# EasyEDA Pro project Charlieplexing.eprj

# Schematic Schematic1
Board Name: Board1; Create Date: 2025-11-15; Page Name: P1; Project Name: Charlieplexing; Schematic Name: Schematic1; Update Date: 2025-11-15; Company: EasyEDA.com; Page Size: A4; Version: V1.0
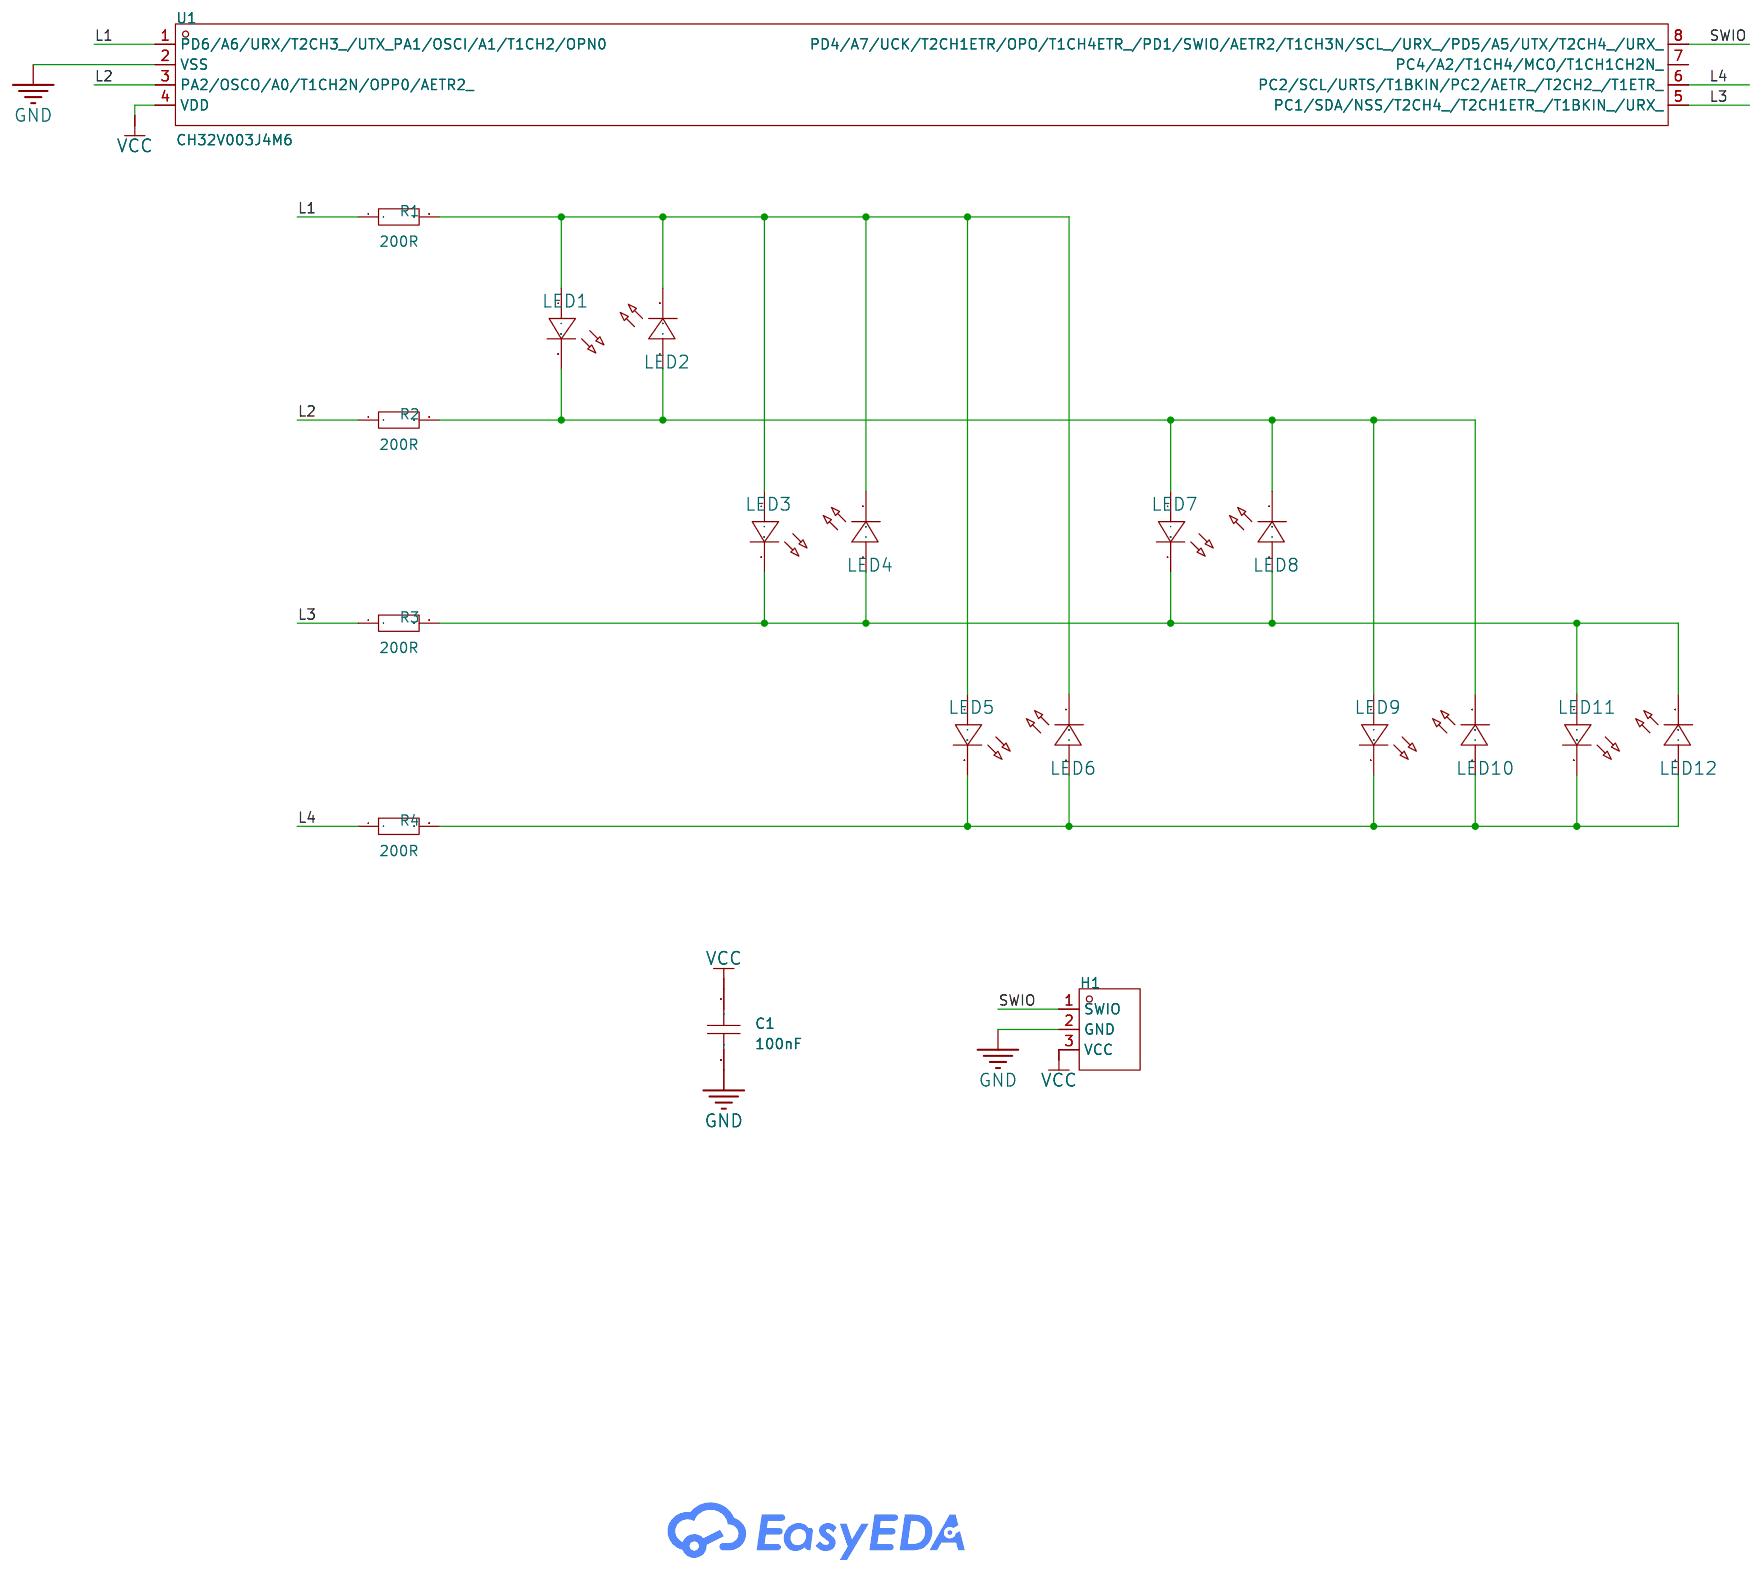
[diagram p0: schematic sheet]

## Parts
C1  100nF  [C0603]
H1  -  [HDR-TH_3P-P2.54-V-M]
LED1  -  [LED0603-R-RD]
LED2  -  [LED0603-R-RD]
LED3  -  [LED0603-R-RD]
LED4  -  [LED0603-R-RD]
LED5  -  [LED0603-R-RD]
LED6  -  [LED0603-R-RD]
LED7  -  [LED0603-R-RD]
LED8  -  [LED0603-R-RD]
LED9  -  [LED0603-R-RD]
LED10  -  [LED0603-R-RD]
LED11  -  [LED0603-R-RD]
LED12  -  [LED0603-R-RD]
R1  200R  [R0603]
R2  200R  [R0603]
R3  200R  [R0603]
R4  200R  [R0603]
U1  CH32V003J4M6  [SOP-8_L4.9-W3.8-P1.27-LS6.0-BL]

## Library data of the parts
C1 = CAP_0603: Supplier Footprint: 0603
H1 = CH32V003 SWIO Header: Supplier Footprint: Through
LED1-LED12 = LED_0603-R: Supplier Footprint: 0603
R1-R4 = Res_0603: Supplier Footprint: 0603
U1 = CH32V003J4M6: Supplier Part: C5346354; Manufacturer: WCH(南京沁恒); Supplier Footprint: SOP-8; JLCPCB Part Class: Extended Part; Datasheet: https://atta.szlcsc.com/upload/public/pdf/source/20240313/8FAFD0DE100342130E64AE37B01CD8FD.pdf; Supplier: LCSC

## Nets
GND: C1.2 H1.2(GND) U1.2(VSS)
VCC: C1.1 H1.3(VCC) U1.4(VDD)
L1: R1.1 U1.1(PD6/A6/URX/T2CH3_/UTX_PA1/OSCI/A1/T1CH2/OPN0)
L2: R2.1 U1.3(PA2/OSCO/A0/T1CH2N/OPP0/AETR2_)
L3: R3.1 U1.5(PC1/SDA/NSS/T2CH4_/T2CH1ETR_/T1BKIN_/URX_)
L4: R4.1 U1.6(PC2/SCL/URTS/T1BKIN/PC2/AETR_/T2CH2_/T1ETR_)
SWIO: H1.1(SWIO) U1.8(PD4/A7/UCK/T2CH1ETR/OPO/T1CH4ETR_/PD1/SWIO/AETR2/T1CH3N/SCL_/URX_/PD5/A5/UTX/T2CH4_/URX_)
$1N184: LED1.1(A) LED2.2(C) LED3.1(A) LED4.2(C) LED5.1(A) LED6.2(C) R1.2
$1N692: LED3.2(C) LED4.1(A) LED7.2(C) LED8.1(A) LED11.1(A) LED12.2(C) R3.2
$1N745: LED5.2(C) LED6.1(A) LED9.2(C) LED10.1(A) LED11.2(C) LED12.1(A) R4.2
Net-(LED1-2): LED1.2(C) LED2.1(A) LED7.1(A) LED8.2(C) LED9.1(A) LED10.2(C) R2.2

Not connected (* = marked no-connect by the designer): U1 7(PC4/A2/T1CH4/MCO/T1CH1CH2N_)

# Schematic Schematic1_1
Board Name: 0402; Create Date: 2025-11-15; Page Name: P1; Project Name: Charlieplexing; Schematic Name: Schematic1_1; Update Date: 2025-11-16; Company: EasyEDA.com; Page Size: A4; Version: V1.0
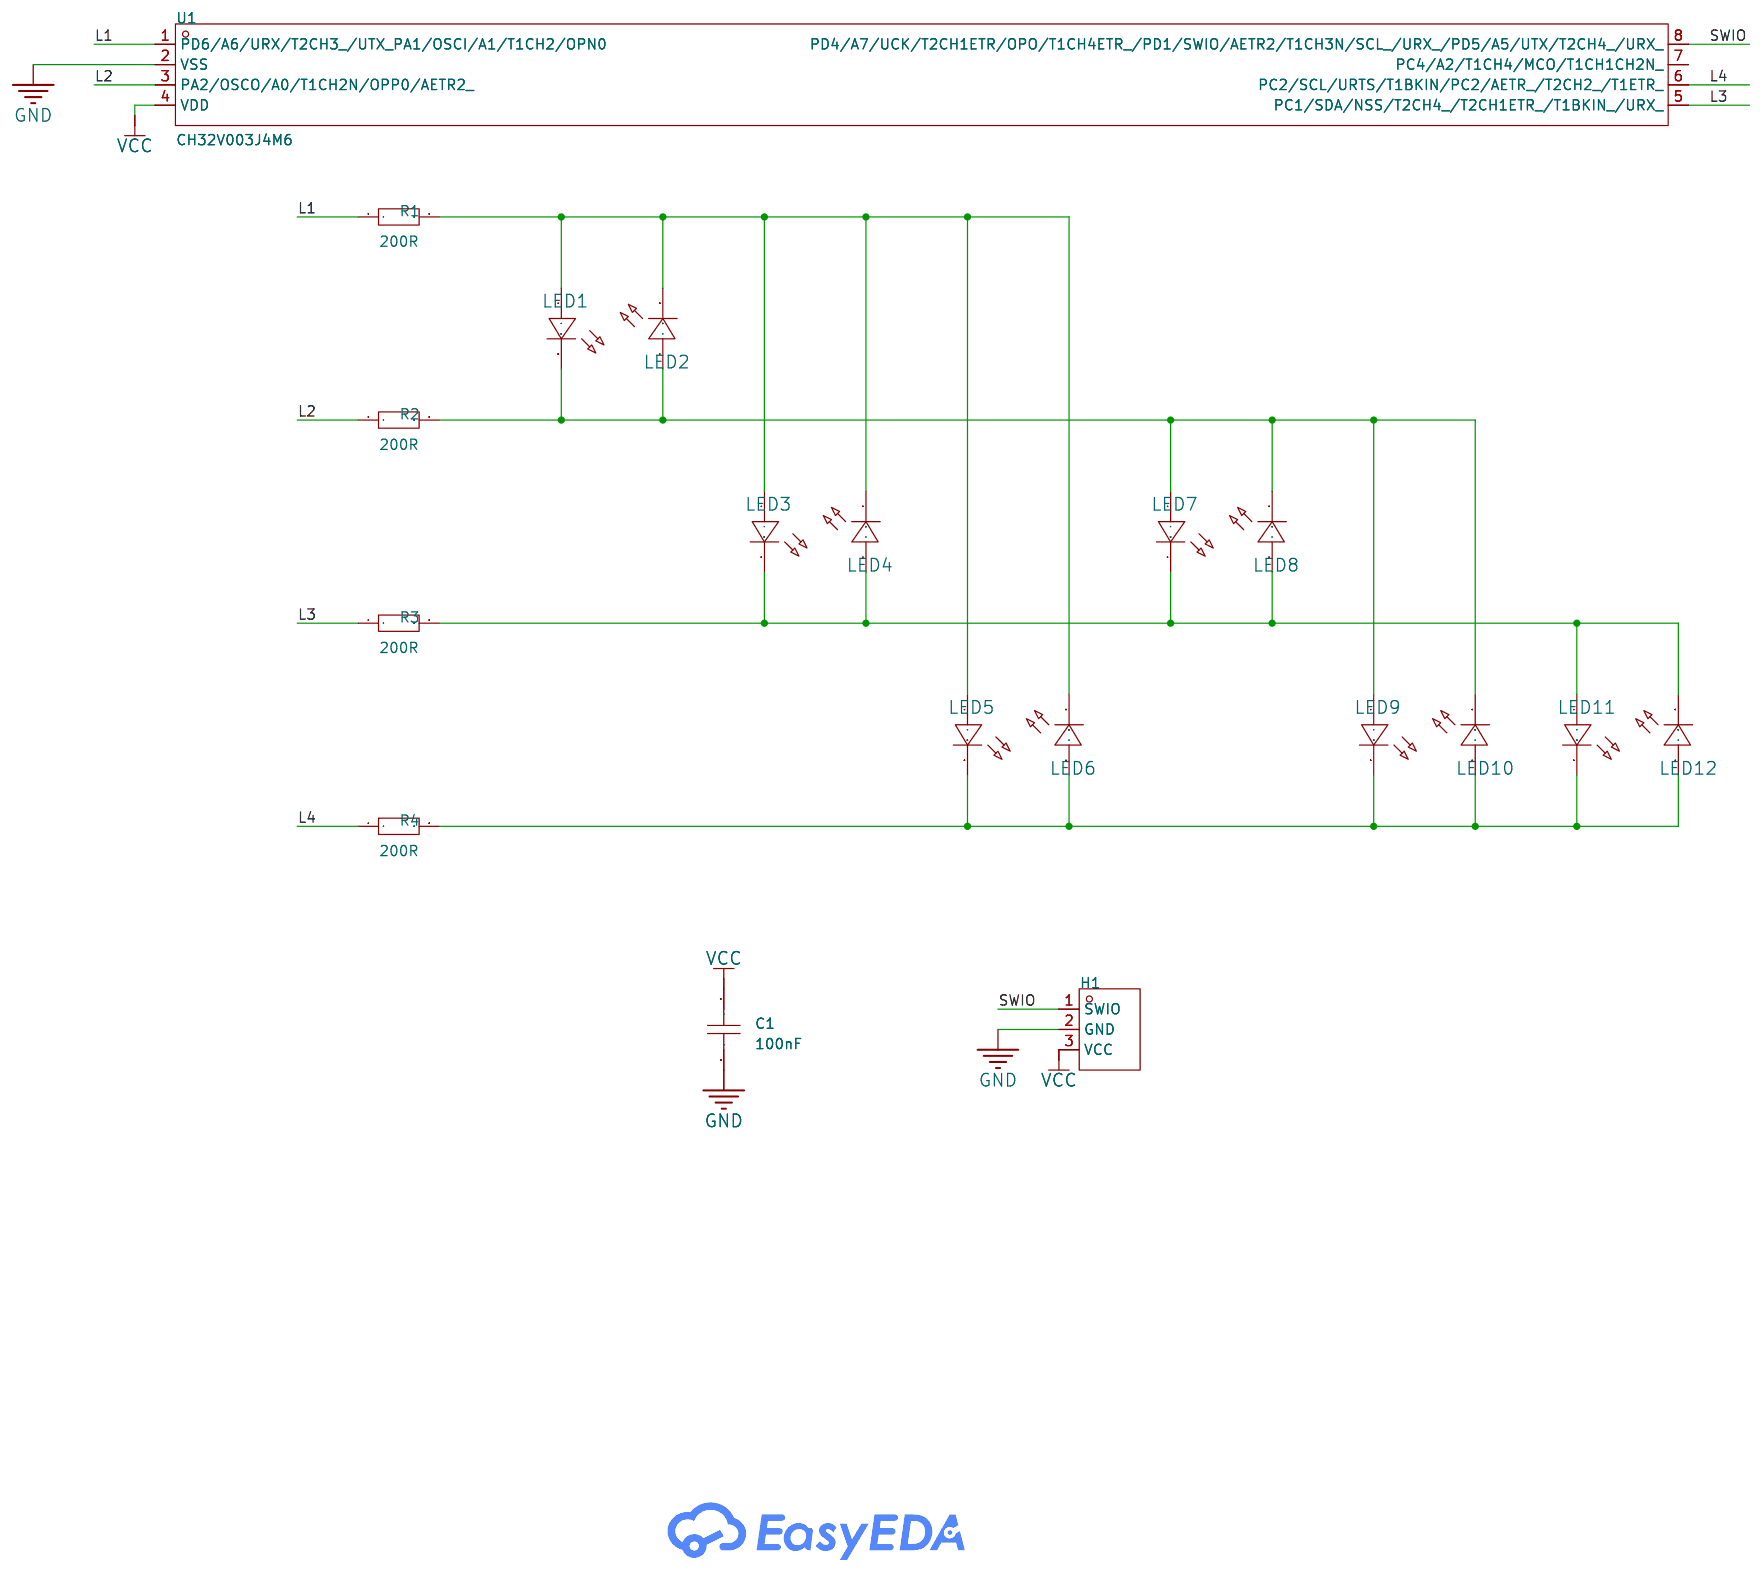
[diagram p1: schematic sheet]

## Parts
C1  100nF  [C0603]
H1  -  [HDR-TH_3P-P2.54-V-M]
LED1  -  [LED0402-R-RD_WHITE]
LED2  -  [LED0402-R-RD_WHITE]
LED3  -  [LED0402-R-RD_WHITE]
LED4  -  [LED0402-R-RD_WHITE]
LED5  -  [LED0402-R-RD_WHITE]
LED6  -  [LED0402-R-RD_WHITE]
LED7  -  [LED0402-R-RD_WHITE]
LED8  -  [LED0402-R-RD_WHITE]
LED9  -  [LED0402-R-RD_WHITE]
LED10  -  [LED0402-R-RD_WHITE]
LED11  -  [LED0402-R-RD_WHITE]
LED12  -  [LED0402-R-RD_WHITE]
R1  200R  [R0402]
R2  200R  [R0402]
R3  200R  [R0402]
R4  200R  [R0402]
U1  CH32V003J4M6  [SOP-8_L4.9-W3.8-P1.27-LS6.0-BL]

## Library data of the parts
C1 = CAP_0603: Supplier Footprint: 0603
H1 = CH32V003 SWIO Header: Supplier Footprint: Through
LED1-LED12 = LED_0603-R: Supplier Footprint: 0603
R1-R4 = Res_0603: Supplier Footprint: 0603
U1 = CH32V003J4M6: Supplier Part: C5346354; Manufacturer: WCH(南京沁恒); Supplier Footprint: SOP-8; JLCPCB Part Class: Extended Part; Datasheet: https://atta.szlcsc.com/upload/public/pdf/source/20240313/8FAFD0DE100342130E64AE37B01CD8FD.pdf; Supplier: LCSC

## Nets
GND: C1.2 H1.2(GND) U1.2(VSS)
VCC: C1.1 H1.3(VCC) U1.4(VDD)
L1: R1.1 U1.1(PD6/A6/URX/T2CH3_/UTX_PA1/OSCI/A1/T1CH2/OPN0)
L2: R2.1 U1.3(PA2/OSCO/A0/T1CH2N/OPP0/AETR2_)
L3: R3.1 U1.5(PC1/SDA/NSS/T2CH4_/T2CH1ETR_/T1BKIN_/URX_)
L4: R4.1 U1.6(PC2/SCL/URTS/T1BKIN/PC2/AETR_/T2CH2_/T1ETR_)
SWIO: H1.1(SWIO) U1.8(PD4/A7/UCK/T2CH1ETR/OPO/T1CH4ETR_/PD1/SWIO/AETR2/T1CH3N/SCL_/URX_/PD5/A5/UTX/T2CH4_/URX_)
$1N184: LED1.1(A) LED2.2(C) LED3.1(A) LED4.2(C) LED5.1(A) LED6.2(C) R1.2
$1N692: LED3.2(C) LED4.1(A) LED7.2(C) LED8.1(A) LED11.1(A) LED12.2(C) R3.2
$1N745: LED5.2(C) LED6.1(A) LED9.2(C) LED10.1(A) LED11.2(C) LED12.1(A) R4.2
Net-(LED1-2): LED1.2(C) LED2.1(A) LED7.1(A) LED8.2(C) LED9.1(A) LED10.2(C) R2.2

Not connected (* = marked no-connect by the designer): U1 7(PC4/A2/T1CH4/MCO/T1CH1CH2N_)

# Board PCB1
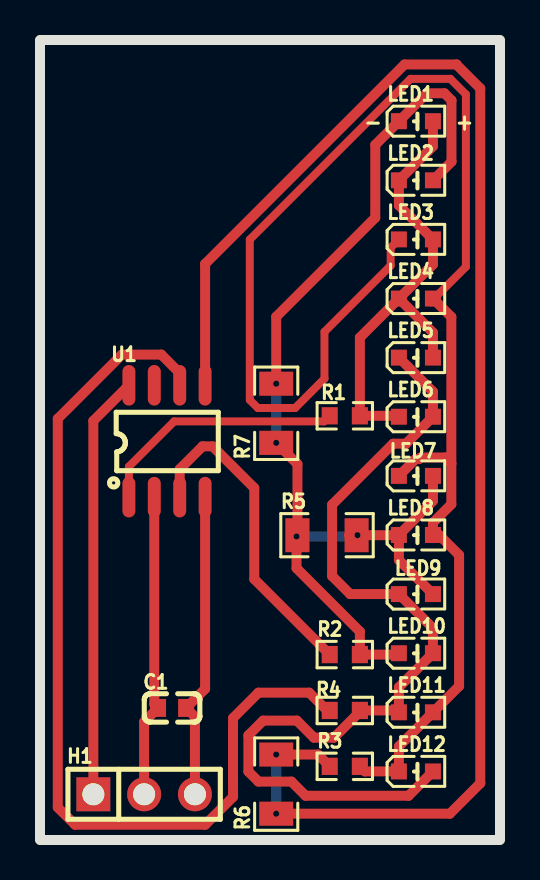
[diagram p2: board, top side]
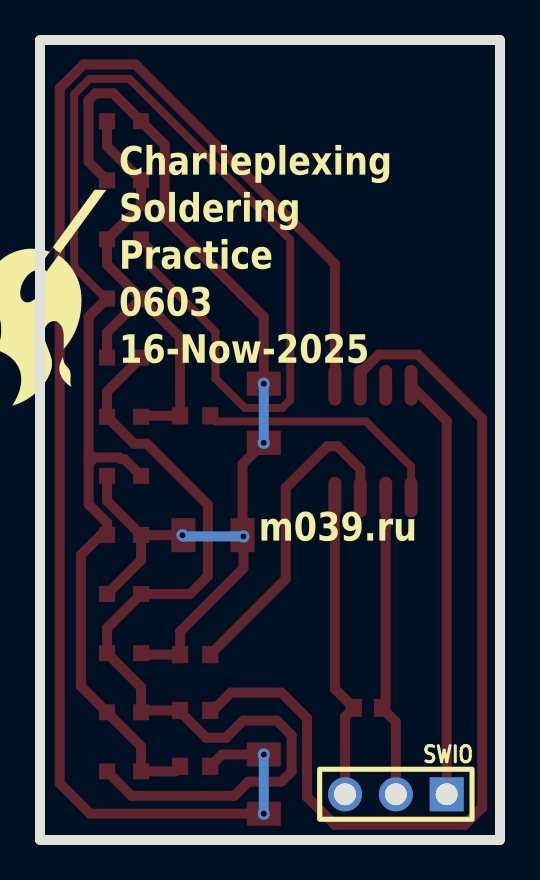
[diagram p3: board, bottom side, seen from below]

Outline 23 x 40 mm; copper layers: Top Layer, Bottom Layer. Coordinates in mm from the lower left corner of the outline.
Outline path: rectangle 0,40 23,0
Stack: Top Layer 0.035mm / Dielectric1 1.51mm FR4 er 4.5 / Bottom Layer 0.035mm

## Design rules (mm)
template: Custom Config
spacing copperThickness1oz (default): track to track 0.27, other pairs 0.152 to 0.3
spacing copperThickness2oz: track to track 0.203, other pairs 0.152 to 0.3
track width copperThickness1oz (default): min 0.127, default 0.5, max 2.54
track width copperThickness2oz: min 0.203, default 0.254, max 2.54
differential pair differentialPair (default): width min 0.127, default 0.254, max 2.54; gap min 0.152, default 0.152
via viaSize (default): diameter min 0.5, default 0.61, max 10; hole min 0.3, default 0.305, max 6.3

## Placement (name value [footprint] x y rotation side)
C1  100nF  [C0603]  6.6 6.6 180 top
H1  -  [HDR-TH_3P-P2.54-V-M]  5.21 2.29 0 top
LED1  -  [LED0603-R-RD]  18.8 35.94 0 top
LED2  -  [LED0603-R-RD]  18.8 32.99 0 top
LED3  -  [LED0603-R-RD]  18.8 30.03 0 top
LED4  -  [LED0603-R-RD]  18.8 27.07 0 top
LED5  -  [LED0603-R-RD]  18.8 24.12 0 top
LED6  -  [LED0603-R-RD]  18.8 21.16 0 top
LED7  -  [LED0603-R-RD]  18.8 18.21 0 top
LED8  -  [LED0603-R-RD]  18.8 15.25 0 top
LED9  -  [LED0603-R-RD]  18.8 12.3 0 top
LED10  -  [LED0603-R-RD]  18.8 9.34 0 top
LED11  -  [LED0603-R-RD]  18.8 6.38 0 top
LED12  -  [LED0603-R-RD]  18.8 3.43 0 top
R1  200R  [R0603]  15.24 21.21 0 top
R2  200R  [R0603]  15.24 9.27 0 top
R3  200R  [R0603]  15.24 3.68 0 top
R4  200R  [R0603]  15.24 6.48 0 top
R5  10kΩ  [R1206]  14.35 15.24 0 top
R6  10kΩ  [R1206]  11.81 2.79 90 top
R7  10kΩ  [R1206]  11.81 21.34 90 top
U1  CH32V003J4M6  [SOP-8_L4.9-W3.8-P1.27-LS6.0-BL]  6.35 19.94 0 top

## Footprints (pads in the part's own frame, mm; a bottom-side part is the same pattern mirrored in y, then rotated)
C0603
  rect 0.8x0.9 smd: 1(-0.7,0) 2(0.7,0)
HDR-TH_3P-P2.54-V-M
  rect 1.7x1.7 hole 1.1: 1(-2.54,0)
  round 1.7 hole 1.1: 2(0,0) 3(2.54,0)
LED0603-R-RD
  rect 0.8x0.8 smd: 1(0.851,0) 2(-0.851,0)
R0603
  rect 0.806x0.864 smd: 1(-0.753,0) 2(0.753,0)
R1206
  rect 1.208x1.701 smd: 1(-1.479,0) 2(1.479,0)
SOP-8_L4.9-W3.8-P1.27-LS6.0-BL
  oval 0.65x2.032 smd: 1(-1.905,-2.796) 2(-0.635,-2.796) 3(0.635,-2.796) 4(1.905,-2.796) 5(1.905,2.796) 6(0.635,2.796) 7(-0.635,2.796) 8(-1.905,2.796)

## Nets
As in the schematic, except:
L3: R3.1 R6.1 R6.2 U1.5
$1N275: LED1.2 LED2.1 LED7.1 LED8.2 LED9.1 LED10.2 R2.2 R5.1 R5.2 R7.1 R7.2

Pads without a net: U1 7

## Via types
v1: diameter 0.61, hole 0.305, Top Layer to Bottom Layer, 6 vias

## Routing (per net, layer and track width the routed paths; a pad name or vN(x,y) marks a point on that pad's centre or on a via; arc(x,y) is an arc through that point)
GND: length 14.7
  Top Layer w0.5: 5.21,2.79 5.21,5.91 C1.2 5.72,6.79 5.72,17.14
VCC: length 14.9
  Top Layer w0.5: 7.75,2.79 7.75,6.16 C1.1 8.25,7.56 8.25,17.14
L1: length 12.6
  Top Layer w0.4: 4.44,17.14 4.44,18.67 6.71,20.93 14.21,20.93 R1.1
L2: length 16.4
  Top Layer w0.5: R2.1 10.72,13.04 10.72,17.6 8.63,19.69 8.13,19.69 6.99,18.54 6.99,17.14
L3: length 75.9
  Top Layer w0.5: R3.1 13.9,4.27 v1(11.81,4.27) ; U1.5 8.25,28.8 18.23,38.78 20.83,38.78 20.83,38.77 22.01,37.58 22.01,2.84 20.49,1.31 v1(11.81,1.31)
  Bottom Layer w0.5: v1(11.81,4.27) v1(11.81,1.31)
L4: length 47.2
  Top Layer w0.5: R4.1 14.35,6.48 13.46,7.37 10.92,7.37 9.65,6.1 9.65,5.55 9.65,5.55 9.65,3.1 9.65,3.1 9.65,2.16 8.26,0.76 1.76,0.76 0.89,1.63 0.89,21.06 4.09,24.27 6.06,24.27 6.99,23.35 U1.6
SWIO: length 20.7
  Top Layer w0.5: 2.67,2.79 2.67,20.96 U1.8
$1N184: length 23.3
  Top Layer w0.5: LED4.2 19.65,28.78 LED3.1 17.94,31.73 LED2.2 19.65,34.69 LED1.1 ; LED4.2 15.99,25.12 R1.2 17.9,21.21 LED6.2 ; LED4.2 19.65,25.37 LED5.1
$1N275: length 53.6
  Top Layer w0.5: LED2.1 20.57,33.91 20.57,36.98 20.22,37.34 19.34,37.34 LED1.2 16.76,34.76 16.76,31.11 11.81,26.16 v1(11.81,22.81) ; LED7.1 19.65,16.95 LED8.2 ; LED10.2 17.88,9.27 R2.2 15.99,10.42 12.83,13.59 v1(12.83,15.18) 12.83,15.49 12.87,15.53 12.87,18.8 v1(11.81,19.86) ; 15.45,15.24 v1(15.88,15.24) 17.93,15.24 LED8.2 ; LED9.1 17.94,14 LED8.2
  Bottom Layer w0.5: v1(15.88,15.24) 15.81,15.18 v1(12.83,15.18) ; v1(11.81,22.81) v1(11.81,19.86)
$1N692: length 78.1
  Top Layer w0.4: LED3.2 17.53,29.62 17.53,28.72 14.22,25.41 14.22,23.07 12.76,21.6 10.89,21.6 10.49,22 10.49,30.02 18.53,38.06 20.52,38.06 21.29,37.28 21.29,28.66 19.68,27.04
  Top Layer w0.5: 20.57,18.83 20.35,19.05 20.34,19.05 20.26,19.13 19.03,19.13 18.95,19.05 18.79,19.05 LED7.2 ; 20.57,18.83 20.57,16.78 19.65,15.86 LED8.1 19.95,15.25 20.96,14.25 20.96,7.69 LED11.1 17.94,4.68 LED12.2 16.25,3.43 R3.2 ; 20.57,18.83 20.57,26.15 19.68,27.04 19.56,26.92
$1N745: length 46
  Top Layer w0.5: LED12.1 18.43,2.21 13.28,2.21 12.57,2.92 10.92,2.92 10.42,3.42 10.42,5.23 11.16,5.97 12.84,5.97 13.7,5.11 14.7,5.11 16.06,6.48 17.85,6.48 LED11.2 17.94,7.64 LED10.1 19.65,10.59 LED9.2 15.51,12.3 14.6,13.2 14.6,16.76 17.66,19.81 18.3,19.81 LED6.1 19.65,22.42 LED5.2

## Text on the board
Bottom Silkscreen Layer: SWIO | m039.ru | Charlieplexing / Soldering / Practice / 0603 / 16-Now-2025
Top Silkscreen Layer: - | +

# Board PCB1_1
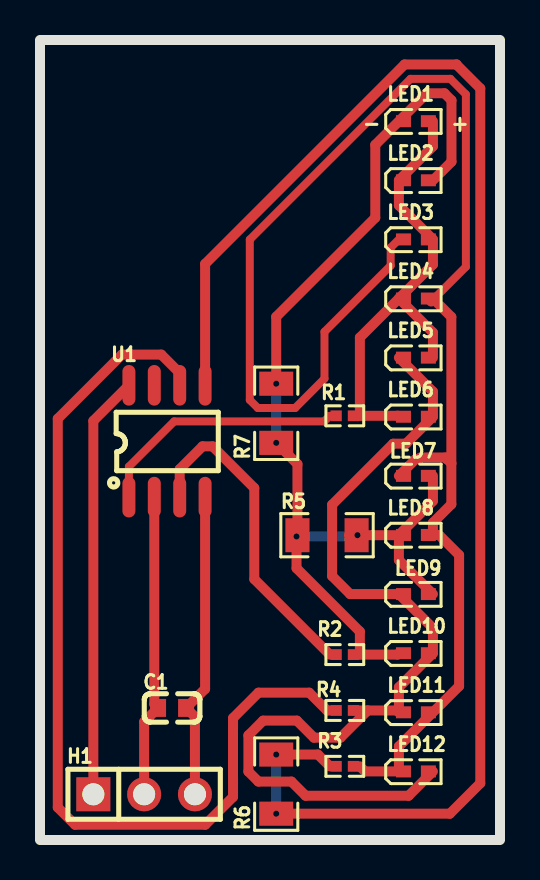
[diagram p4: board, top side]
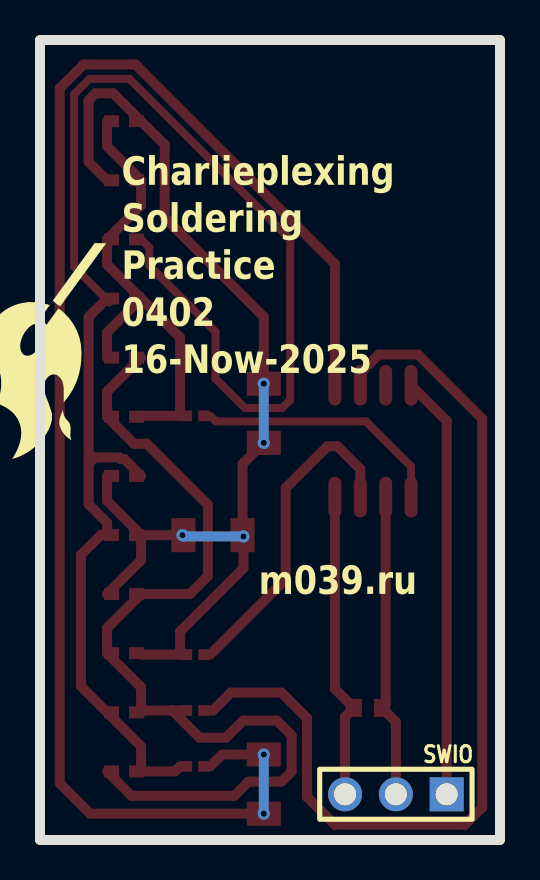
[diagram p5: board, bottom side, seen from below]

Outline 23 x 40 mm; copper layers: Top Layer, Bottom Layer. Coordinates in mm from the lower left corner of the outline.
Outline path: rectangle 0,40 23,0
Stack: Top Layer 0.035mm / Dielectric1 1.51mm FR4 er 4.5 / Bottom Layer 0.035mm

## Design rules (mm)
template: Custom Config
spacing copperThickness1oz (default): track to track 0.27, other pairs 0.152 to 0.3
spacing copperThickness2oz: track to track 0.203, other pairs 0.152 to 0.3
track width copperThickness1oz (default): min 0.127, default 0.5, max 2.54
track width copperThickness2oz: min 0.203, default 0.254, max 2.54
differential pair differentialPair (default): width min 0.127, default 0.254, max 2.54; gap min 0.152, default 0.152
via viaSize (default): diameter min 0.5, default 0.61, max 10; hole min 0.3, default 0.305, max 6.3

## Placement (name value [footprint] x y rotation side)
C1  100nF  [C0603]  6.6 6.6 180 top
H1  -  [HDR-TH_3P-P2.54-V-M]  5.21 2.29 0 top
LED1  -  [LED0402-R-RD_WHITE]  18.8 35.94 0 top
LED2  -  [LED0402-R-RD_WHITE]  18.8 32.99 0 top
LED3  -  [LED0402-R-RD_WHITE]  18.8 30.03 0 top
LED4  -  [LED0402-R-RD_WHITE]  18.8 27.07 0 top
LED5  -  [LED0402-R-RD_WHITE]  18.8 24.12 0 top
LED6  -  [LED0402-R-RD_WHITE]  18.8 21.16 0 top
LED7  -  [LED0402-R-RD_WHITE]  18.8 18.21 0 top
LED8  -  [LED0402-R-RD_WHITE]  18.8 15.25 0 top
LED9  -  [LED0402-R-RD_WHITE]  18.8 12.3 0 top
LED10  -  [LED0402-R-RD_WHITE]  18.8 9.34 0 top
LED11  -  [LED0402-R-RD_WHITE]  18.8 6.38 0 top
LED12  -  [LED0402-R-RD_WHITE]  18.8 3.43 0 top
R1  200R  [R0402]  15.24 21.21 0 top
R2  200R  [R0402]  15.24 9.27 0 top
R3  200R  [R0402]  15.24 3.68 0 top
R4  200R  [R0402]  15.24 6.48 0 top
R5  10kΩ  [R1206]  14.35 15.24 0 top
R6  10kΩ  [R1206]  11.81 2.79 90 top
R7  10kΩ  [R1206]  11.81 21.34 90 top
U1  CH32V003J4M6  [SOP-8_L4.9-W3.8-P1.27-LS6.0-BL]  6.35 19.94 0 top

## Footprints (pads in the part's own frame, mm; a bottom-side part is the same pattern mirrored in y, then rotated)
C0603
  rect 0.8x0.9 smd: 1(-0.7,0) 2(0.7,0)
HDR-TH_3P-P2.54-V-M
  rect 1.7x1.7 hole 1.1: 1(-2.54,0)
  round 1.7 hole 1.1: 2(0,0) 3(2.54,0)
LED0402-R-RD_WHITE
  rect 0.75x0.6 smd: 1(0.623,0) 2(-0.623,0)
R0402
  rect 0.566x0.54 smd: 1(-0.433,0) 2(0.433,0)
R1206
  rect 1.208x1.701 smd: 1(-1.479,0) 2(1.479,0)
SOP-8_L4.9-W3.8-P1.27-LS6.0-BL
  oval 0.65x2.032 smd: 1(-1.905,-2.796) 2(-0.635,-2.796) 3(0.635,-2.796) 4(1.905,-2.796) 5(1.905,2.796) 6(0.635,2.796) 7(-0.635,2.796) 8(-1.905,2.796)

## Nets
As in the schematic, except:
L3: R3.1 R6.1 R6.2 U1.5
$1N275: LED1.2 LED2.1 LED7.1 LED8.2 LED9.1 LED10.2 R2.2 R5.1 R5.2 R7.1 R7.2

Pads without a net: U1 7

## Via types
v1: diameter 0.61, hole 0.305, Top Layer to Bottom Layer, 6 vias

## Routing (per net, layer and track width the routed paths; a pad name or vN(x,y) marks a point on that pad's centre or on a via; arc(x,y) is an arc through that point)
GND: length 14.7
  Top Layer w0.5: 5.21,2.79 5.21,5.91 C1.2 5.72,6.79 5.72,17.14
VCC: length 14.9
  Top Layer w0.5: 7.75,2.79 7.75,6.16 C1.1 8.25,7.56 8.25,17.14
L1: length 12.6
  Top Layer w0.4: 4.44,17.14 4.44,18.67 6.71,20.93 14.21,20.93 14.49,21.21
L2: length 16.4
  Top Layer w0.5: 6.99,17.14 6.99,18.54 8.13,19.69 8.63,19.69 10.72,17.6 10.72,13.04 14.49,9.27
L3: length 75.9
  Top Layer w0.5: 14.49,3.68 13.9,4.27 v1(11.81,4.27) ; v1(11.81,1.31) 20.49,1.31 22.01,2.84 22.01,37.58 20.83,38.77 20.83,38.78 18.23,38.78 8.25,28.8 U1.5
  Bottom Layer w0.5: v1(11.81,4.27) v1(11.81,1.31)
L4: length 47.2
  Top Layer w0.5: U1.6 6.99,23.35 6.06,24.27 4.09,24.27 0.89,21.06 0.89,1.63 1.76,0.76 8.26,0.76 9.65,2.16 9.65,3.1 9.65,3.1 9.65,5.55 9.65,5.55 9.65,6.1 10.92,7.37 13.46,7.37 14.35,6.48 14.49,6.48
SWIO: length 20.7
  Top Layer w0.5: U1.8 2.67,20.96 2.67,2.79
$1N184: length 23.3
  Top Layer w0.5: 17.94,21.16 17.9,21.21 15.99,21.21 15.99,25.12 17.94,27.07 ; 17.94,27.07 19.65,25.37 19.65,24.12 ; 17.94,27.07 19.65,28.78 19.65,30.03 17.94,31.73 17.94,32.99 19.65,34.69 19.65,35.94
$1N275: length 53.6
  Top Layer w0.5: v1(11.81,22.81) 11.81,26.16 16.76,31.11 16.76,34.76 19.34,37.34 20.22,37.34 20.57,36.98 20.57,33.91 19.65,32.99 ; 17.94,15.25 17.94,14 19.65,12.3 ; 17.94,15.25 17.93,15.24 v1(15.88,15.24) 15.45,15.24 ; 17.94,15.25 19.65,16.95 19.65,18.21 ; v1(11.81,19.86) 12.87,18.8 12.87,15.53 12.83,15.49 v1(12.83,15.18) 12.83,13.59 15.99,10.42 15.99,9.27 17.88,9.27 17.94,9.34
  Bottom Layer w0.5: v1(12.83,15.18) 15.81,15.18 v1(15.88,15.24) ; v1(11.81,22.81) v1(11.81,19.86)
$1N692: length 78.1
  Top Layer w0.4: 19.68,27.04 21.29,28.66 21.29,37.28 20.52,38.06 18.53,38.06 10.49,30.02 10.49,22 10.89,21.6 12.76,21.6 14.22,23.07 14.22,25.41 17.53,28.72 17.53,29.62 17.94,30.03
  Top Layer w0.5: 20.57,18.83 20.35,19.05 20.34,19.05 20.26,19.13 19.03,19.13 18.95,19.05 18.79,19.05 17.94,18.21 ; 20.57,18.83 20.57,16.78 19.65,15.86 19.65,15.25 19.95,15.25 20.96,14.25 20.96,7.69 17.94,4.68 17.94,3.43 16.25,3.43 15.99,3.68 ; 20.57,18.83 20.57,26.15 19.68,27.04 19.56,26.92
$1N745: length 46.7
  Top Layer w0.5: 16.38,6.48 17.85,6.48 17.94,6.38 17.94,7.64 19.65,9.34 19.65,10.59 17.94,12.3 15.51,12.3 14.6,13.2 14.6,16.76 17.66,19.81 18.3,19.81 19.65,21.16 19.65,22.42 17.94,24.12 ; 16.38,6.48 15.02,5.11 13.7,5.11 12.84,5.97 11.16,5.97 10.42,5.23 10.42,3.42 10.92,2.92 12.57,2.92 13.28,2.21 18.43,2.21 19.65,3.43 ; 16.38,6.48 R4.2

## Text on the board
Bottom Silkscreen Layer: SWIO | m039.ru | Charlieplexing / Soldering / Practice / 0402 / 16-Now-2025
Top Silkscreen Layer: - | +
